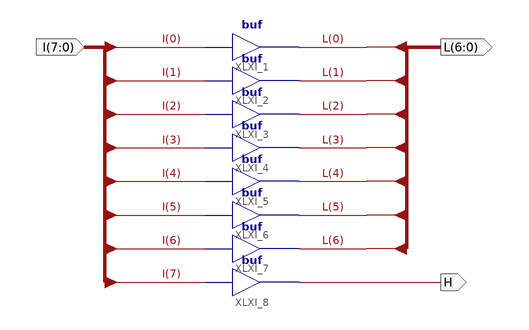
[diagram p0: schematic sheet 1]
// Xilinx ISE schematic split8x7x1.sch (spartan6) as structural Verilog: 8 symbols, 3 ports
module split8x7x1 (
  input  [7:0] I,
  output [6:0] L,
  output H
);

  buf XLXI_1 (L[0], I[0]);
  buf XLXI_2 (L[1], I[1]);
  buf XLXI_3 (L[2], I[2]);
  buf XLXI_4 (L[3], I[3]);
  buf XLXI_5 (L[4], I[4]);
  buf XLXI_6 (L[5], I[5]);
  buf XLXI_7 (L[6], I[6]);
  buf XLXI_8 (H, I[7]);
endmodule
